# Altium schematic sheet FMC_PCIe_Carrier.SchDoc: SPEC - top
size 594 x 420 mm; CheckedBy: MC, TW, EB; CompanyName: CERN; DrawnBy: Greg Kasprowicz; Organization: CERN; Address1: European Organization for Nuclear Research; Address2: CH-1211 Genиve 23 - Switzerland; DocumentNumber: 1; Revision: -; SheetNumber: 1; SheetTotal: 17; EDA_Number: EDA-02189-V4-0; Projet: Simple PCIe Carrier Board; ModifiedBy: TW, MC; CreateDate: 10/07/2010; CheckedDate: 11/05/2011; DivGrp: BE-CO; Designer: GK, MC, TW, EB, PAS; ModifiedDate: -; ProjectName: Simple PCIE Carrier Board
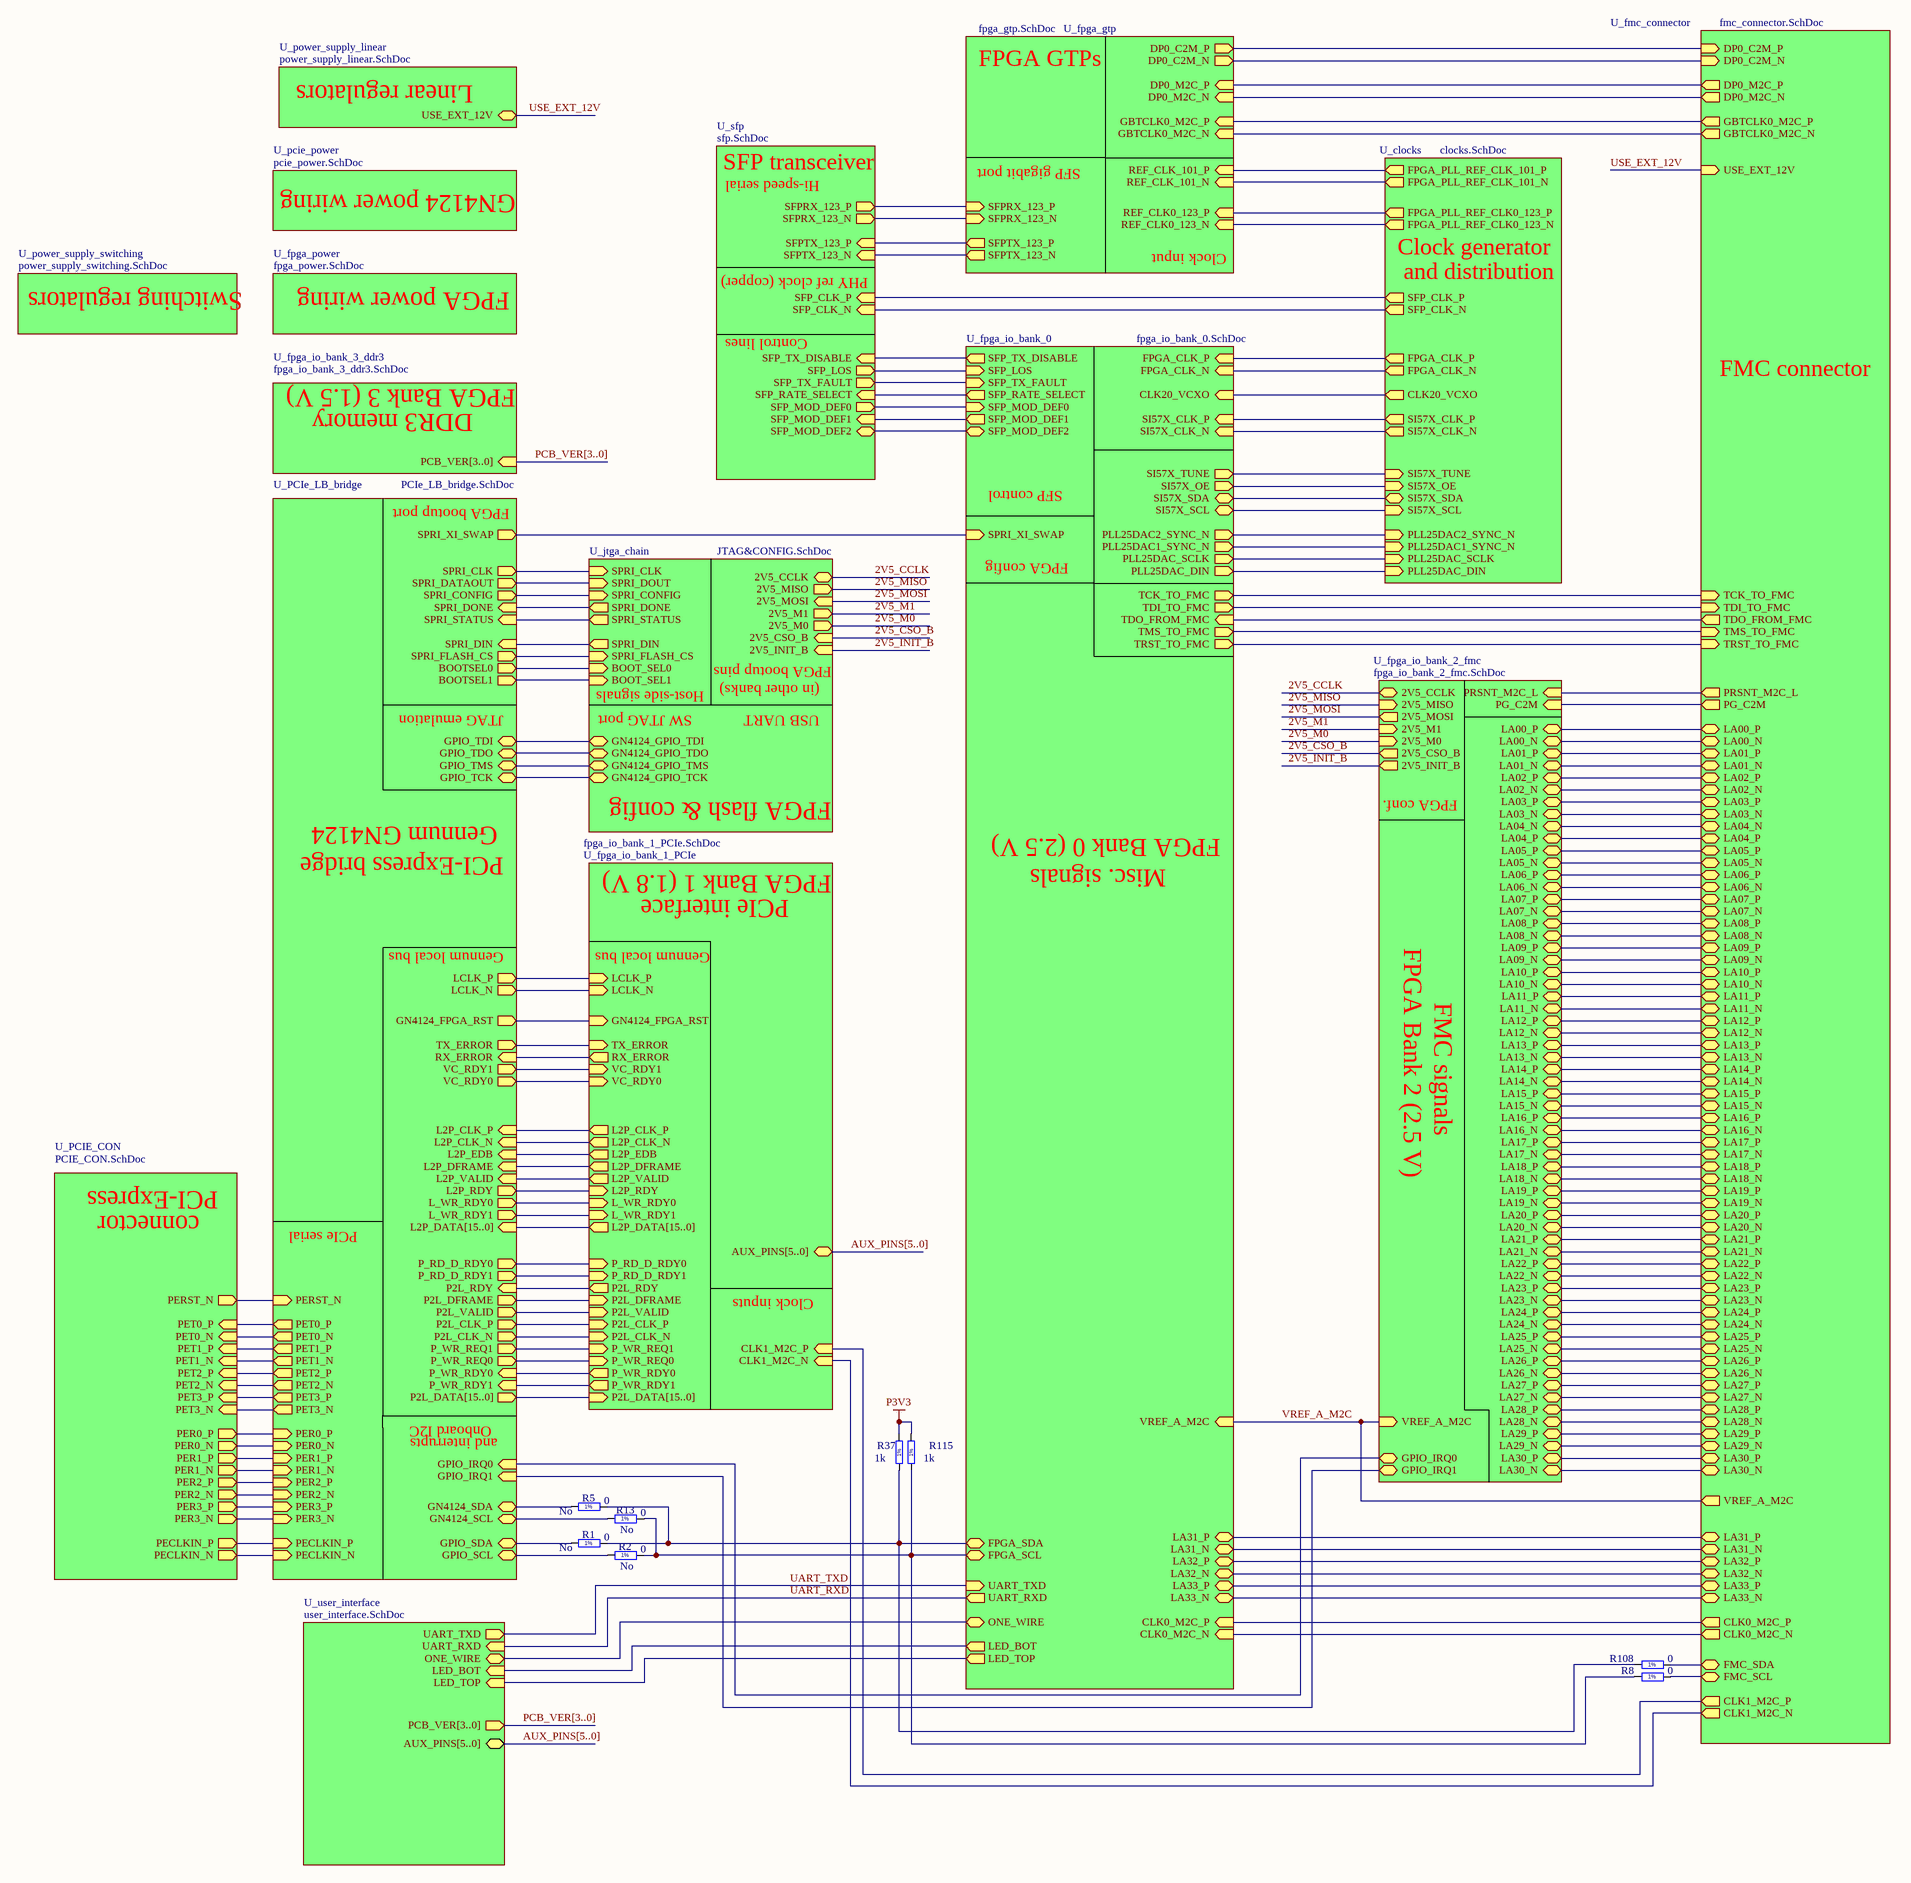
[diagram p0: FMC_PCIe_Carrier.SchDoc]

## Parts
R1  0  Mounted: No  [RESC1608X55N]
R2  0  Mounted: No  [RESC1608X55N]
R5  0  Mounted: No  [RESC1608X55N]
R8  0  [RESC1608X55N]
R13  0  Mounted: No  [RESC1608X55N]
R37  1k  [RESC1608X55N]
R108  0  [RESC1608X55N]
R115  1k  [RESC1608X55N]

## Sub-sheets
U_clocks = clocks.SchDoc: PLL25DAC_SCLK (in), PLL25DAC_DIN (in), SI57X_OE (in), SI57X_CLK_P (out), SI57X_CLK_N (out), FPGA_PLL_REF_CLK0_123_N (out), FPGA_PLL_REF_CLK0_123_P (out), FPGA_PLL_REF_CLK_101_N (out), FPGA_PLL_REF_CLK_101_P (out), FPGA_CLK_P (out), FPGA_CLK_N (out), PLL25DAC1_SYNC_N (in), PLL25DAC2_SYNC_N (in), CLK20_VCXO (out), SI57X_SDA (bidir), SI57X_SCL (in), SFP_CLK_P (out), SFP_CLK_N (out), SI57X_TUNE (in)
U_fmc_connector = fmc_connector.SchDoc: LA01_P (bidir), LA01_N (bidir), LA05_P (bidir), LA05_N (bidir), LA11_P (bidir), CLK1_M2C_P (out), CLK1_M2C_N (out), VREF_A_M2C (out), CLK0_M2C_P (out), CLK0_M2C_N (out), LA02_P (bidir), LA02_N (bidir), LA04_N (bidir), LA04_P (bidir), LA03_P (bidir), LA03_N (bidir), LA00_P (bidir), LA00_N (bidir), LA06_P (bidir), LA06_N (bidir), LA07_P (bidir), LA07_N (bidir), LA09_P (bidir), LA09_N (bidir), LA13_P (bidir), LA13_N (bidir), LA08_P (bidir), LA08_N (bidir), LA10_P (bidir), LA10_N (bidir), LA11_N (bidir), LA12_P (bidir), LA12_N (bidir), LA24_P (bidir), LA24_N (bidir), LA17_P (bidir), LA17_N (bidir), LA14_P (bidir), LA14_N (bidir), LA15_P (bidir), LA15_N (bidir), LA16_P (bidir), LA16_N (bidir), LA18_P (bidir), LA18_N (bidir), LA19_P (bidir), LA19_N (bidir), LA20_P (bidir), LA20_N (bidir), LA21_P (bidir), LA21_N (bidir), LA22_P (bidir), LA22_N (bidir), LA23_P (bidir), LA23_N (bidir), LA25_P (bidir), LA25_N (bidir), LA26_N (bidir), LA26_P (bidir), LA27_P (bidir), LA27_N (bidir), LA28_P (bidir), LA28_N (bidir), LA29_P (bidir), LA29_N (bidir), LA33_P (bidir), LA33_N (bidir), LA32_P (bidir), LA32_N (bidir), LA30_P (bidir), LA30_N (bidir), LA31_P (bidir), LA31_N (bidir), PG_C2M (out), PRSNT_M2C_L (out), TCK_TO_FMC (in), TDI_TO_FMC (in), TDO_FROM_FMC (out), TMS_TO_FMC (in), TRST_TO_FMC (in), FMC_SCL (bidir), FMC_SDA (bidir), DP0_C2M_P (in), DP0_C2M_N (in), DP0_M2C_P (out), DP0_M2C_N (out), GBTCLK0_M2C_P (out), GBTCLK0_M2C_N (out), USE_EXT_12V (in)
U_fpga_gtp = fpga_gtp.SchDoc: SFPRX_123_N (in), SFPRX_123_P (in), SFPTX_123_N (out), SFPTX_123_P (out), DP0_M2C_N (in), DP0_M2C_P (in), GBTCLK0_M2C_N (in), GBTCLK0_M2C_P (in), DP0_C2M_N (out), DP0_C2M_P (out), REF_CLK0_123_N (in), REF_CLK0_123_P (in), REF_CLK_101_N (in), REF_CLK_101_P (in)
U_fpga_io_bank_0 = fpga_io_bank_0.SchDoc: SPRI_XI_SWAP (in), SFP_MOD_DEF0 (in), FPGA_SDA (bidir), FPGA_SCL (bidir), SFP_TX_DISABLE (out), SFP_RATE_SELECT (out), SFP_TX_FAULT (in), SFP_MOD_DEF2 (bidir), SFP_LOS (in), TMS_TO_FMC (out), TCK_TO_FMC (out), TDO_FROM_FMC (in), TDI_TO_FMC (out), TRST_TO_FMC (out), SFP_MOD_DEF1 (out), SI57X_OE (out), SI57X_CLK_P (in), SI57X_CLK_N (in), PLL25DAC_SCLK (out), PLL25DAC_DIN (out), VREF_A_M2C (in), LA31_P (bidir), LA31_N (bidir), LA32_P (bidir), LA32_N (bidir), LA33_P (bidir), LA33_N (bidir), FPGA_CLK_P (in), FPGA_CLK_N (in), PLL25DAC1_SYNC_N (out), PLL25DAC2_SYNC_N (out), CLK20_VCXO (in), CLK0_M2C_P (in), CLK0_M2C_N (in), LED_TOP (out), LED_BOT (out), SI57X_SDA (bidir), SI57X_SCL (bidir), UART_RXD (out), UART_TXD (in), SI57X_TUNE (out), ONE_WIRE (bidir)
U_fpga_io_bank_1_PCIe = fpga_io_bank_1_PCIe.SchDoc: P2L_DATA[15..0] (in), L2P_DATA[15..0] (out), L2P_CLK_P (out), L2P_CLK_N (out), L2P_EDB (out), L2P_DFRAME (out), L2P_VALID (out), L2P_RDY (in), L_WR_RDY0 (in), L_WR_RDY1 (in), P_RD_D_RDY0 (in), P_RD_D_RDY1 (in), P2L_RDY (out), P2L_DFRAME (in), P2L_VALID (in), P2L_CLK_P (in), P2L_CLK_N (in), P_WR_REQ1 (in), P_WR_REQ0 (in), P_WR_RDY0 (out), P_WR_RDY1 (out), VC_RDY0 (in), VC_RDY1 (in), RX_ERROR (out), TX_ERROR (in), GN4124_FPGA_RST (in), LCLK_P (in), LCLK_N (in), CLK1_M2C_P (in), CLK1_M2C_N (in), AUX_PINS[5..0] (bidir)
U_fpga_io_bank_2_fmc = fpga_io_bank_2_fmc.SchDoc: LA00_P (bidir), LA00_N (bidir), LA01_P (bidir), LA01_N (bidir), LA02_P (bidir), LA03_P (bidir), LA02_N (bidir), LA05_P (bidir), LA05_N (bidir), LA11_P (bidir), LA04_N (bidir), LA04_P (bidir), LA03_N (bidir), LA06_P (bidir), LA06_N (bidir), LA07_P (bidir), LA07_N (bidir), LA09_P (bidir), LA09_N (bidir), LA13_P (bidir), LA13_N (bidir), LA08_P (bidir), LA08_N (bidir), LA10_P (bidir), LA10_N (bidir), LA11_N (bidir), LA12_P (bidir), LA12_N (bidir), LA24_P (bidir), LA24_N (bidir), LA17_P (bidir), LA17_N (bidir), LA14_P (bidir), LA14_N (bidir), LA15_P (bidir), LA15_N (bidir), LA16_P (bidir), LA16_N (bidir), LA18_P (bidir), LA18_N (bidir), LA19_P (bidir), LA19_N (bidir), LA20_P (bidir), LA20_N (bidir), LA21_P (bidir), LA21_N (bidir), LA22_P (bidir), LA22_N (bidir), LA23_P (bidir), LA23_N (bidir), LA25_P (bidir), LA25_N (bidir), LA26_N (bidir), LA26_P (bidir), LA27_P (bidir), LA27_N (bidir), LA28_P (bidir), LA28_N (bidir), LA29_P (bidir), LA29_N (bidir), LA30_P (bidir), LA30_N (bidir), VREF_A_M2C (in), 2V5_CCLK (bidir), 2V5_MISO (in), 2V5_MOSI (out), 2V5_M1 (in), 2V5_M0 (in), 2V5_CSO_B (out), 2V5_INIT_B (out), GPIO_IRQ0 (bidir), GPIO_IRQ1 (bidir), PRSNT_M2C_L (in), PG_C2M (in)
U_fpga_io_bank_3_ddr3 = fpga_io_bank_3_ddr3.SchDoc: PCB_VER[3..0] (in)
U_fpga_power = fpga_power.SchDoc: no entries
U_jtga_chain = JTAG&CONFIG.SchDoc: GN4124_GPIO_TDI (bidir), GN4124_GPIO_TMS (bidir), GN4124_GPIO_TCK (bidir), GN4124_GPIO_TDO (bidir), SPRI_STATUS (out), SPRI_DONE (out), 2V5_M0 (out), 2V5_M1 (out), 2V5_CSO_B (in), 2V5_INIT_B (in), 2V5_CCLK (bidir), 2V5_MOSI (in), 2V5_MISO (out), SPRI_CONFIG (in), SPRI_CLK (in), SPRI_DOUT (in), SPRI_DIN (out), SPRI_FLASH_CS (in), BOOT_SEL0 (in), BOOT_SEL1 (in)
U_PCIE_CON = PCIE_CON.SchDoc: PERST_N (out), PET3_N (in), PET3_P (in), PET2_N (in), PET2_P (in), PET1_N (in), PET1_P (in), PET0_N (in), PET0_P (in), PECLKIN_N (out), PECLKIN_P (out), PER0_P (out), PER0_N (out), PER1_P (out), PER1_N (out), PER2_P (out), PER2_N (out), PER3_P (out), PER3_N (out)
U_PCIe_LB_bridge = PCIe_LB_bridge.SchDoc: PET0_N (out), PET1_N (out), PET2_N (out), PET3_N (out), PET0_P (out), PET1_P (out), PET2_P (out), PET3_P (out), SPRI_CLK (out), SPRI_DATAOUT (out), SPRI_CONFIG (out), SPRI_DONE (in), SPRI_XI_SWAP (out), SPRI_STATUS (in), PECLKIN_N (in), PECLKIN_P (in), PERST_N (in), GN4124_FPGA_RST (out), LCLK_P (out), LCLK_N (out), P2L_DATA[15..0] (out), P2L_DFRAME (out), P2L_VALID (out), P2L_CLK_P (out), P2L_CLK_N (out), P_WR_REQ1 (out), P_WR_REQ0 (out), P_WR_RDY0 (in), P_WR_RDY1 (in), VC_RDY0 (out), VC_RDY1 (out), P2L_RDY (in), RX_ERROR (in), L2P_DATA[15..0] (in), L2P_DFRAME (in), L2P_VALID (in), L2P_EDB (in), L2P_CLK_P (in), L2P_CLK_N (in), L_WR_RDY0 (out), L_WR_RDY1 (out), P_RD_D_RDY0 (out), P_RD_D_RDY1 (out), L2P_RDY (out), TX_ERROR (out), PER0_N (in), PER1_N (in), PER2_N (in), PER3_N (in), PER0_P (in), PER1_P (in), PER2_P (in), PER3_P (in), GN4124_SDA (bidir), GN4124_SCL (bidir), GPIO_SCL (bidir), GPIO_SDA (bidir), GPIO_TDI (bidir), GPIO_TDO (bidir), GPIO_TMS (bidir), GPIO_TCK (bidir), GPIO_IRQ0 (in), GPIO_IRQ1 (in), BOOTSEL0 (out), BOOTSEL1 (out), SPRI_DIN (in), SPRI_FLASH_CS (out)
U_pcie_power = pcie_power.SchDoc: no entries
U_power_supply_linear = power_supply_linear.SchDoc: USE_EXT_12V (bidir)
U_power_supply_switching = power_supply_switching.SchDoc: no entries
U_sfp = sfp.SchDoc: SFP_TX_FAULT (out), SFP_LOS (out), SFP_TX_DISABLE (in), SFP_MOD_DEF2 (bidir), SFP_MOD_DEF1 (in), SFP_MOD_DEF0 (out), SFP_RATE_SELECT (in), SFPRX_123_P (out), SFPRX_123_N (out), SFPTX_123_P (in), SFPTX_123_N (in), SFP_CLK_P (in), SFP_CLK_N (in)
U_user_interface = user_interface.SchDoc: UART_TXD (out), UART_RXD (in), LED_BOT (in), LED_TOP (in), AUX_PINS[5..0] (bidir), PCB_VER[3..0] (out), ONE_WIRE (bidir)

## Nets
P3V3: R37.2 R115.2
2V5_CCLK: sheet U_jtga_chain/2V5_CCLK, sheet U_fpga_io_bank_2_fmc/2V5_CCLK
2V5_CSO_B: sheet U_jtga_chain/2V5_CSO_B, sheet U_fpga_io_bank_2_fmc/2V5_CSO_B
2V5_INIT_B: sheet U_jtga_chain/2V5_INIT_B, sheet U_fpga_io_bank_2_fmc/2V5_INIT_B
2V5_M0: sheet U_jtga_chain/2V5_M0, sheet U_fpga_io_bank_2_fmc/2V5_M0
2V5_M1: sheet U_jtga_chain/2V5_M1, sheet U_fpga_io_bank_2_fmc/2V5_M1
2V5_MISO: sheet U_jtga_chain/2V5_MISO, sheet U_fpga_io_bank_2_fmc/2V5_MISO
2V5_MOSI: sheet U_jtga_chain/2V5_MOSI, sheet U_fpga_io_bank_2_fmc/2V5_MOSI
UART_RXD: sheet U_fpga_io_bank_0/UART_RXD, sheet U_user_interface/UART_RXD
UART_TXD: sheet U_fpga_io_bank_0/UART_TXD, sheet U_user_interface/UART_TXD
USE_EXT_12V: sheet U_fmc_connector/USE_EXT_12V, sheet U_power_supply_linear/USE_EXT_12V
VREF_A_M2C: sheet U_fmc_connector/VREF_A_M2C, sheet U_fpga_io_bank_2_fmc/VREF_A_M2C, sheet U_fpga_io_bank_0/VREF_A_M2C
NetR1_1: R1.1 ; sheet U_PCIe_LB_bridge/GPIO_SDA
NetR1_2: R1.2 R5.2 R37.1 R108.1 ; sheet U_fpga_io_bank_0/FPGA_SDA
NetR2_1: R2.1 ; sheet U_PCIe_LB_bridge/GPIO_SCL
NetR2_2: R2.2 R8.1 R13.2 R115.1 ; sheet U_fpga_io_bank_0/FPGA_SCL
NetR5_1: R5.1 ; sheet U_PCIe_LB_bridge/GN4124_SDA
NetR8_2: R8.2 ; sheet U_fmc_connector/FMC_SCL
NetR13_1: R13.1 ; sheet U_PCIe_LB_bridge/GN4124_SCL
NetR108_2: R108.2 ; sheet U_fmc_connector/FMC_SDA
(unnamed): sheet U_PCIe_LB_bridge/PET0_N, sheet U_PCIE_CON/PET0_N
(unnamed): sheet U_PCIe_LB_bridge/PET1_N, sheet U_PCIE_CON/PET1_N
(unnamed): sheet U_PCIe_LB_bridge/PET2_N, sheet U_PCIE_CON/PET2_N
(unnamed): sheet U_PCIe_LB_bridge/PET3_N, sheet U_PCIE_CON/PET3_N
(unnamed): sheet U_PCIe_LB_bridge/PET0_P, sheet U_PCIE_CON/PET0_P
(unnamed): sheet U_PCIe_LB_bridge/PET1_P, sheet U_PCIE_CON/PET1_P
(unnamed): sheet U_PCIe_LB_bridge/PET2_P, sheet U_PCIE_CON/PET2_P
(unnamed): sheet U_PCIe_LB_bridge/PET3_P, sheet U_PCIE_CON/PET3_P
(unnamed): sheet U_PCIe_LB_bridge/SPRI_CLK, sheet U_jtga_chain/SPRI_CLK
(unnamed): sheet U_PCIe_LB_bridge/SPRI_DATAOUT, sheet U_jtga_chain/SPRI_DOUT
(unnamed): sheet U_PCIe_LB_bridge/SPRI_CONFIG, sheet U_jtga_chain/SPRI_CONFIG
(unnamed): sheet U_PCIe_LB_bridge/SPRI_DONE, sheet U_jtga_chain/SPRI_DONE
(unnamed): sheet U_PCIe_LB_bridge/SPRI_XI_SWAP, sheet U_fpga_io_bank_0/SPRI_XI_SWAP
(unnamed): sheet U_PCIe_LB_bridge/SPRI_STATUS, sheet U_jtga_chain/SPRI_STATUS
(unnamed): sheet U_PCIe_LB_bridge/PECLKIN_N, sheet U_PCIE_CON/PECLKIN_N
(unnamed): sheet U_PCIe_LB_bridge/PECLKIN_P, sheet U_PCIE_CON/PECLKIN_P
(unnamed): sheet U_PCIe_LB_bridge/PERST_N, sheet U_PCIE_CON/PERST_N
(unnamed): sheet U_PCIe_LB_bridge/GN4124_FPGA_RST, sheet U_fpga_io_bank_1_PCIe/GN4124_FPGA_RST
(unnamed): sheet U_PCIe_LB_bridge/LCLK_P, sheet U_fpga_io_bank_1_PCIe/LCLK_P
(unnamed): sheet U_PCIe_LB_bridge/LCLK_N, sheet U_fpga_io_bank_1_PCIe/LCLK_N
(unnamed): sheet U_PCIe_LB_bridge/P2L_DFRAME, sheet U_fpga_io_bank_1_PCIe/P2L_DFRAME
(unnamed): sheet U_PCIe_LB_bridge/P2L_VALID, sheet U_fpga_io_bank_1_PCIe/P2L_VALID
(unnamed): sheet U_PCIe_LB_bridge/P2L_CLK_P, sheet U_fpga_io_bank_1_PCIe/P2L_CLK_P
(unnamed): sheet U_PCIe_LB_bridge/P2L_CLK_N, sheet U_fpga_io_bank_1_PCIe/P2L_CLK_N
(unnamed): sheet U_PCIe_LB_bridge/P_WR_REQ1, sheet U_fpga_io_bank_1_PCIe/P_WR_REQ1
(unnamed): sheet U_PCIe_LB_bridge/P_WR_REQ0, sheet U_fpga_io_bank_1_PCIe/P_WR_REQ0
(unnamed): sheet U_PCIe_LB_bridge/P_WR_RDY0, sheet U_fpga_io_bank_1_PCIe/P_WR_RDY0
(unnamed): sheet U_PCIe_LB_bridge/P_WR_RDY1, sheet U_fpga_io_bank_1_PCIe/P_WR_RDY1
(unnamed): sheet U_PCIe_LB_bridge/VC_RDY0, sheet U_fpga_io_bank_1_PCIe/VC_RDY0
(unnamed): sheet U_PCIe_LB_bridge/VC_RDY1, sheet U_fpga_io_bank_1_PCIe/VC_RDY1
(unnamed): sheet U_PCIe_LB_bridge/P2L_RDY, sheet U_fpga_io_bank_1_PCIe/P2L_RDY
(unnamed): sheet U_PCIe_LB_bridge/RX_ERROR, sheet U_fpga_io_bank_1_PCIe/RX_ERROR
(unnamed): sheet U_PCIe_LB_bridge/L2P_DFRAME, sheet U_fpga_io_bank_1_PCIe/L2P_DFRAME
(unnamed): sheet U_PCIe_LB_bridge/L2P_VALID, sheet U_fpga_io_bank_1_PCIe/L2P_VALID
(unnamed): sheet U_PCIe_LB_bridge/L2P_EDB, sheet U_fpga_io_bank_1_PCIe/L2P_EDB
(unnamed): sheet U_PCIe_LB_bridge/L2P_CLK_P, sheet U_fpga_io_bank_1_PCIe/L2P_CLK_P
(unnamed): sheet U_PCIe_LB_bridge/L2P_CLK_N, sheet U_fpga_io_bank_1_PCIe/L2P_CLK_N
(unnamed): sheet U_PCIe_LB_bridge/L_WR_RDY0, sheet U_fpga_io_bank_1_PCIe/L_WR_RDY0
(unnamed): sheet U_PCIe_LB_bridge/L_WR_RDY1, sheet U_fpga_io_bank_1_PCIe/L_WR_RDY1
(unnamed): sheet U_PCIe_LB_bridge/P_RD_D_RDY0, sheet U_fpga_io_bank_1_PCIe/P_RD_D_RDY0
(unnamed): sheet U_PCIe_LB_bridge/P_RD_D_RDY1, sheet U_fpga_io_bank_1_PCIe/P_RD_D_RDY1
(unnamed): sheet U_PCIe_LB_bridge/L2P_RDY, sheet U_fpga_io_bank_1_PCIe/L2P_RDY
(unnamed): sheet U_PCIe_LB_bridge/TX_ERROR, sheet U_fpga_io_bank_1_PCIe/TX_ERROR
(unnamed): sheet U_PCIe_LB_bridge/PER0_N, sheet U_PCIE_CON/PER0_N
(unnamed): sheet U_PCIe_LB_bridge/PER1_N, sheet U_PCIE_CON/PER1_N
(unnamed): sheet U_PCIe_LB_bridge/PER2_N, sheet U_PCIE_CON/PER2_N
(unnamed): sheet U_PCIe_LB_bridge/PER3_N, sheet U_PCIE_CON/PER3_N
(unnamed): sheet U_PCIe_LB_bridge/PER0_P, sheet U_PCIE_CON/PER0_P
(unnamed): sheet U_PCIe_LB_bridge/PER1_P, sheet U_PCIE_CON/PER1_P
(unnamed): sheet U_PCIe_LB_bridge/PER2_P, sheet U_PCIE_CON/PER2_P
(unnamed): sheet U_PCIe_LB_bridge/PER3_P, sheet U_PCIE_CON/PER3_P
(unnamed): sheet U_PCIe_LB_bridge/GPIO_TDI, sheet U_jtga_chain/GN4124_GPIO_TDI
(unnamed): sheet U_PCIe_LB_bridge/GPIO_TDO, sheet U_jtga_chain/GN4124_GPIO_TDO
(unnamed): sheet U_PCIe_LB_bridge/GPIO_TMS, sheet U_jtga_chain/GN4124_GPIO_TMS
(unnamed): sheet U_PCIe_LB_bridge/GPIO_TCK, sheet U_jtga_chain/GN4124_GPIO_TCK
(unnamed): sheet U_PCIe_LB_bridge/GPIO_IRQ0, sheet U_fpga_io_bank_2_fmc/GPIO_IRQ0
(unnamed): sheet U_PCIe_LB_bridge/GPIO_IRQ1, sheet U_fpga_io_bank_2_fmc/GPIO_IRQ1
(unnamed): sheet U_PCIe_LB_bridge/BOOTSEL0, sheet U_jtga_chain/BOOT_SEL0
(unnamed): sheet U_PCIe_LB_bridge/BOOTSEL1, sheet U_jtga_chain/BOOT_SEL1
(unnamed): sheet U_PCIe_LB_bridge/SPRI_DIN, sheet U_jtga_chain/SPRI_DIN
(unnamed): sheet U_PCIe_LB_bridge/SPRI_FLASH_CS, sheet U_jtga_chain/SPRI_FLASH_CS
(unnamed): sheet U_fmc_connector/LA01_P, sheet U_fpga_io_bank_2_fmc/LA01_P
(unnamed): sheet U_fmc_connector/LA01_N, sheet U_fpga_io_bank_2_fmc/LA01_N
(unnamed): sheet U_fmc_connector/LA05_P, sheet U_fpga_io_bank_2_fmc/LA05_P
(unnamed): sheet U_fmc_connector/LA05_N, sheet U_fpga_io_bank_2_fmc/LA05_N
(unnamed): sheet U_fmc_connector/LA11_P, sheet U_fpga_io_bank_2_fmc/LA11_P
(unnamed): sheet U_fmc_connector/CLK1_M2C_P, sheet U_fpga_io_bank_1_PCIe/CLK1_M2C_P
(unnamed): sheet U_fmc_connector/CLK1_M2C_N, sheet U_fpga_io_bank_1_PCIe/CLK1_M2C_N
(unnamed): sheet U_fmc_connector/CLK0_M2C_P, sheet U_fpga_io_bank_0/CLK0_M2C_P
(unnamed): sheet U_fmc_connector/CLK0_M2C_N, sheet U_fpga_io_bank_0/CLK0_M2C_N
(unnamed): sheet U_fmc_connector/LA02_P, sheet U_fpga_io_bank_2_fmc/LA02_P
(unnamed): sheet U_fmc_connector/LA02_N, sheet U_fpga_io_bank_2_fmc/LA02_N
(unnamed): sheet U_fmc_connector/LA04_N, sheet U_fpga_io_bank_2_fmc/LA04_N
(unnamed): sheet U_fmc_connector/LA04_P, sheet U_fpga_io_bank_2_fmc/LA04_P
(unnamed): sheet U_fmc_connector/LA03_P, sheet U_fpga_io_bank_2_fmc/LA03_P
(unnamed): sheet U_fmc_connector/LA03_N, sheet U_fpga_io_bank_2_fmc/LA03_N
(unnamed): sheet U_fmc_connector/LA00_P, sheet U_fpga_io_bank_2_fmc/LA00_P
(unnamed): sheet U_fmc_connector/LA00_N, sheet U_fpga_io_bank_2_fmc/LA00_N
(unnamed): sheet U_fmc_connector/LA06_P, sheet U_fpga_io_bank_2_fmc/LA06_P
(unnamed): sheet U_fmc_connector/LA06_N, sheet U_fpga_io_bank_2_fmc/LA06_N
(unnamed): sheet U_fmc_connector/LA07_P, sheet U_fpga_io_bank_2_fmc/LA07_P
(unnamed): sheet U_fmc_connector/LA07_N, sheet U_fpga_io_bank_2_fmc/LA07_N
(unnamed): sheet U_fmc_connector/LA09_P, sheet U_fpga_io_bank_2_fmc/LA09_P
(unnamed): sheet U_fmc_connector/LA09_N, sheet U_fpga_io_bank_2_fmc/LA09_N
(unnamed): sheet U_fmc_connector/LA13_P, sheet U_fpga_io_bank_2_fmc/LA13_P
(unnamed): sheet U_fmc_connector/LA13_N, sheet U_fpga_io_bank_2_fmc/LA13_N
(unnamed): sheet U_fmc_connector/LA08_P, sheet U_fpga_io_bank_2_fmc/LA08_P
(unnamed): sheet U_fmc_connector/LA08_N, sheet U_fpga_io_bank_2_fmc/LA08_N
(unnamed): sheet U_fmc_connector/LA10_P, sheet U_fpga_io_bank_2_fmc/LA10_P
(unnamed): sheet U_fmc_connector/LA10_N, sheet U_fpga_io_bank_2_fmc/LA10_N
(unnamed): sheet U_fmc_connector/LA11_N, sheet U_fpga_io_bank_2_fmc/LA11_N
(unnamed): sheet U_fmc_connector/LA12_P, sheet U_fpga_io_bank_2_fmc/LA12_P
(unnamed): sheet U_fmc_connector/LA12_N, sheet U_fpga_io_bank_2_fmc/LA12_N
(unnamed): sheet U_fmc_connector/LA24_P, sheet U_fpga_io_bank_2_fmc/LA24_P
(unnamed): sheet U_fmc_connector/LA24_N, sheet U_fpga_io_bank_2_fmc/LA24_N
(unnamed): sheet U_fmc_connector/LA17_P, sheet U_fpga_io_bank_2_fmc/LA17_P
(unnamed): sheet U_fmc_connector/LA17_N, sheet U_fpga_io_bank_2_fmc/LA17_N
(unnamed): sheet U_fmc_connector/LA14_P, sheet U_fpga_io_bank_2_fmc/LA14_P
(unnamed): sheet U_fmc_connector/LA14_N, sheet U_fpga_io_bank_2_fmc/LA14_N
(unnamed): sheet U_fmc_connector/LA15_P, sheet U_fpga_io_bank_2_fmc/LA15_P
(unnamed): sheet U_fmc_connector/LA15_N, sheet U_fpga_io_bank_2_fmc/LA15_N
(unnamed): sheet U_fmc_connector/LA16_P, sheet U_fpga_io_bank_2_fmc/LA16_P
(unnamed): sheet U_fmc_connector/LA16_N, sheet U_fpga_io_bank_2_fmc/LA16_N
(unnamed): sheet U_fmc_connector/LA18_P, sheet U_fpga_io_bank_2_fmc/LA18_P
(unnamed): sheet U_fmc_connector/LA18_N, sheet U_fpga_io_bank_2_fmc/LA18_N
(unnamed): sheet U_fmc_connector/LA19_P, sheet U_fpga_io_bank_2_fmc/LA19_P
(unnamed): sheet U_fmc_connector/LA19_N, sheet U_fpga_io_bank_2_fmc/LA19_N
(unnamed): sheet U_fmc_connector/LA20_P, sheet U_fpga_io_bank_2_fmc/LA20_P
(unnamed): sheet U_fmc_connector/LA20_N, sheet U_fpga_io_bank_2_fmc/LA20_N
(unnamed): sheet U_fmc_connector/LA21_P, sheet U_fpga_io_bank_2_fmc/LA21_P
(unnamed): sheet U_fmc_connector/LA21_N, sheet U_fpga_io_bank_2_fmc/LA21_N
(unnamed): sheet U_fmc_connector/LA22_P, sheet U_fpga_io_bank_2_fmc/LA22_P
(unnamed): sheet U_fmc_connector/LA22_N, sheet U_fpga_io_bank_2_fmc/LA22_N
(unnamed): sheet U_fmc_connector/LA23_P, sheet U_fpga_io_bank_2_fmc/LA23_P
(unnamed): sheet U_fmc_connector/LA23_N, sheet U_fpga_io_bank_2_fmc/LA23_N
(unnamed): sheet U_fmc_connector/LA25_P, sheet U_fpga_io_bank_2_fmc/LA25_P
(unnamed): sheet U_fmc_connector/LA25_N, sheet U_fpga_io_bank_2_fmc/LA25_N
(unnamed): sheet U_fmc_connector/LA26_N, sheet U_fpga_io_bank_2_fmc/LA26_N
(unnamed): sheet U_fmc_connector/LA26_P, sheet U_fpga_io_bank_2_fmc/LA26_P
(unnamed): sheet U_fmc_connector/LA27_P, sheet U_fpga_io_bank_2_fmc/LA27_P
(unnamed): sheet U_fmc_connector/LA27_N, sheet U_fpga_io_bank_2_fmc/LA27_N
(unnamed): sheet U_fmc_connector/LA28_P, sheet U_fpga_io_bank_2_fmc/LA28_P
(unnamed): sheet U_fmc_connector/LA28_N, sheet U_fpga_io_bank_2_fmc/LA28_N
(unnamed): sheet U_fmc_connector/LA29_P, sheet U_fpga_io_bank_2_fmc/LA29_P
(unnamed): sheet U_fmc_connector/LA29_N, sheet U_fpga_io_bank_2_fmc/LA29_N
(unnamed): sheet U_fmc_connector/LA33_P, sheet U_fpga_io_bank_0/LA33_P
(unnamed): sheet U_fmc_connector/LA33_N, sheet U_fpga_io_bank_0/LA33_N
(unnamed): sheet U_fmc_connector/LA32_P, sheet U_fpga_io_bank_0/LA32_P
(unnamed): sheet U_fmc_connector/LA32_N, sheet U_fpga_io_bank_0/LA32_N
(unnamed): sheet U_fmc_connector/LA30_P, sheet U_fpga_io_bank_2_fmc/LA30_P
(unnamed): sheet U_fmc_connector/LA30_N, sheet U_fpga_io_bank_2_fmc/LA30_N
(unnamed): sheet U_fmc_connector/LA31_P, sheet U_fpga_io_bank_0/LA31_P
(unnamed): sheet U_fmc_connector/LA31_N, sheet U_fpga_io_bank_0/LA31_N
(unnamed): sheet U_fmc_connector/PG_C2M, sheet U_fpga_io_bank_2_fmc/PG_C2M
(unnamed): sheet U_fmc_connector/PRSNT_M2C_L, sheet U_fpga_io_bank_2_fmc/PRSNT_M2C_L
(unnamed): sheet U_fmc_connector/TCK_TO_FMC, sheet U_fpga_io_bank_0/TCK_TO_FMC
(unnamed): sheet U_fmc_connector/TDI_TO_FMC, sheet U_fpga_io_bank_0/TDI_TO_FMC
(unnamed): sheet U_fmc_connector/TDO_FROM_FMC, sheet U_fpga_io_bank_0/TDO_FROM_FMC
(unnamed): sheet U_fmc_connector/TMS_TO_FMC, sheet U_fpga_io_bank_0/TMS_TO_FMC
(unnamed): sheet U_fmc_connector/TRST_TO_FMC, sheet U_fpga_io_bank_0/TRST_TO_FMC
(unnamed): sheet U_fmc_connector/DP0_C2M_P, sheet U_fpga_gtp/DP0_C2M_P
(unnamed): sheet U_fmc_connector/DP0_C2M_N, sheet U_fpga_gtp/DP0_C2M_N
(unnamed): sheet U_fmc_connector/DP0_M2C_P, sheet U_fpga_gtp/DP0_M2C_P
(unnamed): sheet U_fmc_connector/DP0_M2C_N, sheet U_fpga_gtp/DP0_M2C_N
(unnamed): sheet U_fmc_connector/GBTCLK0_M2C_P, sheet U_fpga_gtp/GBTCLK0_M2C_P
(unnamed): sheet U_fmc_connector/GBTCLK0_M2C_N, sheet U_fpga_gtp/GBTCLK0_M2C_N
(unnamed): sheet U_sfp/SFP_TX_FAULT, sheet U_fpga_io_bank_0/SFP_TX_FAULT
(unnamed): sheet U_sfp/SFP_LOS, sheet U_fpga_io_bank_0/SFP_LOS
(unnamed): sheet U_sfp/SFP_TX_DISABLE, sheet U_fpga_io_bank_0/SFP_TX_DISABLE
(unnamed): sheet U_sfp/SFP_MOD_DEF2, sheet U_fpga_io_bank_0/SFP_MOD_DEF2
(unnamed): sheet U_sfp/SFP_MOD_DEF1, sheet U_fpga_io_bank_0/SFP_MOD_DEF1
(unnamed): sheet U_sfp/SFP_MOD_DEF0, sheet U_fpga_io_bank_0/SFP_MOD_DEF0
(unnamed): sheet U_sfp/SFP_RATE_SELECT, sheet U_fpga_io_bank_0/SFP_RATE_SELECT
(unnamed): sheet U_sfp/SFPRX_123_P, sheet U_fpga_gtp/SFPRX_123_P
(unnamed): sheet U_sfp/SFPRX_123_N, sheet U_fpga_gtp/SFPRX_123_N
(unnamed): sheet U_sfp/SFPTX_123_P, sheet U_fpga_gtp/SFPTX_123_P
(unnamed): sheet U_sfp/SFPTX_123_N, sheet U_fpga_gtp/SFPTX_123_N
(unnamed): sheet U_sfp/SFP_CLK_P, sheet U_clocks/SFP_CLK_P
(unnamed): sheet U_sfp/SFP_CLK_N, sheet U_clocks/SFP_CLK_N
(unnamed): sheet U_clocks/PLL25DAC_SCLK, sheet U_fpga_io_bank_0/PLL25DAC_SCLK
(unnamed): sheet U_clocks/PLL25DAC_DIN, sheet U_fpga_io_bank_0/PLL25DAC_DIN
(unnamed): sheet U_clocks/SI57X_OE, sheet U_fpga_io_bank_0/SI57X_OE
(unnamed): sheet U_clocks/SI57X_CLK_P, sheet U_fpga_io_bank_0/SI57X_CLK_P
(unnamed): sheet U_clocks/SI57X_CLK_N, sheet U_fpga_io_bank_0/SI57X_CLK_N
(unnamed): sheet U_clocks/FPGA_PLL_REF_CLK0_123_N, sheet U_fpga_gtp/REF_CLK0_123_N
(unnamed): sheet U_clocks/FPGA_PLL_REF_CLK0_123_P, sheet U_fpga_gtp/REF_CLK0_123_P
(unnamed): sheet U_clocks/FPGA_PLL_REF_CLK_101_N, sheet U_fpga_gtp/REF_CLK_101_N
(unnamed): sheet U_clocks/FPGA_PLL_REF_CLK_101_P, sheet U_fpga_gtp/REF_CLK_101_P
(unnamed): sheet U_clocks/FPGA_CLK_P, sheet U_fpga_io_bank_0/FPGA_CLK_P
(unnamed): sheet U_clocks/FPGA_CLK_N, sheet U_fpga_io_bank_0/FPGA_CLK_N
(unnamed): sheet U_clocks/PLL25DAC1_SYNC_N, sheet U_fpga_io_bank_0/PLL25DAC1_SYNC_N
(unnamed): sheet U_clocks/PLL25DAC2_SYNC_N, sheet U_fpga_io_bank_0/PLL25DAC2_SYNC_N
(unnamed): sheet U_clocks/CLK20_VCXO, sheet U_fpga_io_bank_0/CLK20_VCXO
(unnamed): sheet U_clocks/SI57X_SDA, sheet U_fpga_io_bank_0/SI57X_SDA
(unnamed): sheet U_clocks/SI57X_SCL, sheet U_fpga_io_bank_0/SI57X_SCL
(unnamed): sheet U_clocks/SI57X_TUNE, sheet U_fpga_io_bank_0/SI57X_TUNE
(unnamed): sheet U_fpga_io_bank_0/LED_TOP, sheet U_user_interface/LED_TOP
(unnamed): sheet U_fpga_io_bank_0/LED_BOT, sheet U_user_interface/LED_BOT
(unnamed): sheet U_fpga_io_bank_0/ONE_WIRE, sheet U_user_interface/ONE_WIRE

## Buses and harness runs
bus AUX_PINS[5..0] = sheet U_fpga_io_bank_1_PCIe/AUX_PINS[5..0]
bus AUX_PINS[5..0] = sheet U_user_interface/AUX_PINS[5..0]
bus PCB_VER[3..0] = sheet U_fpga_io_bank_3_ddr3/PCB_VER[3..0]
bus PCB_VER[3..0] = sheet U_user_interface/PCB_VER[3..0]
bus sheet U_fpga_io_bank_1_PCIe/L2P_DATA[15..0] = sheet U_PCIe_LB_bridge/L2P_DATA[15..0]
bus sheet U_fpga_io_bank_1_PCIe/P2L_DATA[15..0] = sheet U_PCIe_LB_bridge/P2L_DATA[15..0]

## Notes on the sheet
- Linear regulators
- FPGA GTPs
- SFP transceiver
- Hi-speed serial
- SFP gigabit port
- GN4124 power wiring
- Clock input
- Switching regulators
- FPGA power wiring
- PHY ref clock (copper)
- Clock generator
- and distribution
- Control lines
- DDR3 memory
- FPGA Bank 3 (1.5 V)
- FMC connector
- SFP control
- FPGA bootup port
- FPGA config
- FPGA bootup pins
- JTAG emulation
- SW JTAG port
- Host-side signals
- (in other banks)
- USB UART
- Gennum GN4124
- PCI-Express bridge
- FPGA flash & config
- FPGA Bank 0 (2.5 V)
- FPGA conf.
- PCIe interface
- FPGA Bank 1 (1.8 V)
- Misc. signals
- Gennum local bus
- FPGA Bank 2 (2.5 V)
- FMC signals
- connector
- PCI-Express
- PCIe serial
- Clock inputs
- Onboard I2C
- and interrupts
- Project/Equipment
- Document
- File
- Designer
- Drawn by
- Check.by
- Last Mod.
- Print Date
- Sheet
- Size
- A2
- of
- Rev
- (in symbol R0603_0R_JUMPER) 1%
- (in symbol R0603_1K_1%_0.1W_100PPM) 1%

## Library data of the parts
R1 R2 R5 R8 R13 R108 = R0603_0R_JUMPER: Resistor - 1%; Part Description: 1A (0.05R Max DC Resistance) Zero Ohm Jumper; Manufacturer: GENERIC; Manufacturer1 Part Number: NRC06Z0; Table: Resistors SMD; Part Number: R0603_0R_JUMPER; Component Kind: Standard; Component Type: Standard; Pin Count: 2; Value: 0; Status: Preferred; Manufacturer Part Number: R0603_0R_JUMPER; Case: 0603; Socket: No; SMD: Yes; Manufacturer1 Example: NIC COMPONENT; Manufacturer1 ComponentHeight: 0.55mm; HelpURL: \\cern.ch\dfs\Applications\Altium\Datasheets\R0603_NIC_NRC.pdf; Author: CERN DEM JLC; CreateDate: 12/3/2007; LatestRevisionDate: 3/13/2008
  R8 R108: Mounted: Yes
R37 R115 = R0603_1K_1%_0.1W_100PPM: Resistor - 1%; Part Description: General Purpose Thick Film Chip Resistor; Manufacturer: GENERIC; Manufacturer1 Part Number: NRC06F1001TRF; Power: 0.1W; TC: ±100ppm/°C; Table: Resistors SMD; Part Number: R0603_1K_1%_0.1W_100PPM; Component Kind: Standard; Component Type: Standard; Pin Count: 2; Value: 1k; Status: Preferred; Tolerance: ±1%; Manufacturer Part Number: R0603_1K_1%_0.1W_100PPM; Case: 0603; Mounted: Yes; Socket: No; SMD: Yes; Manufacturer1 Example: NIC COMPONENT; Manufacturer1 ComponentHeight: 0.55mm; HelpURL: \\cern.ch\dfs\Applications\Altium\Datasheets\R0603_NIC_NRC.pdf; Author: CERN DEM JLC; CreateDate: 12/3/2007; LatestRevisionDate: 3/13/2008